# EAGLE design Zocalo-mcp2515 (EAGLE 7.4.0)
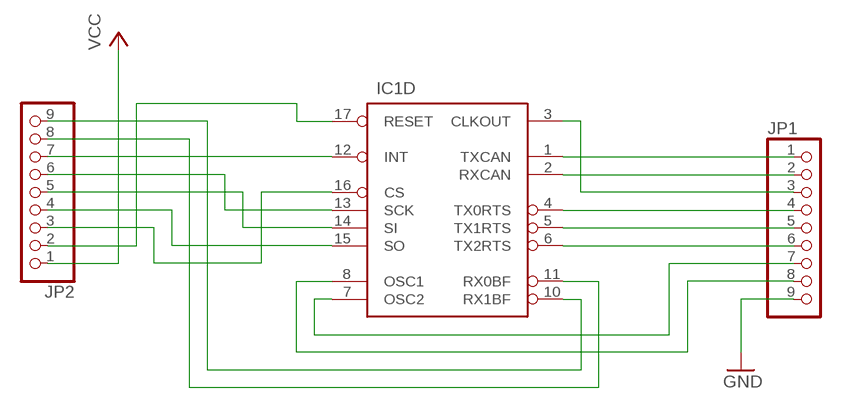
[diagram p0: schematic, sheet 1]

## Parts
IC1  MCP2515SO  [SO-18W]
JP1  PINHD-1X9  [1X09]
JP2  PINHD-1X9  [1X09]

## Nets
GND: JP1.9
N$1: IC1.1(D:TXCAN) JP1.1
N$2: IC1.2(D:RXCAN) JP1.2
N$3: IC1.4(D:TX0RTS) JP1.4
N$4: IC1.5(D:TX1RTS) JP1.5
N$5: IC1.6(D:TX2RTS) JP1.6
N$6: IC1.3(D:CLKOUT) JP1.3
N$7: IC1.7(D:OSC2) JP1.7
N$8: IC1.8(D:OSC1) JP1.8
N$9: IC1.10(D:RX1BF) JP2.9
N$10: IC1.11(D:RX0BF) JP2.8
N$11: IC1.12(D:INT) JP2.7
N$12: IC1.13(D:SCK) JP2.6
N$13: IC1.14(D:SI) JP2.5
N$14: IC1.15(D:SO) JP2.4
N$15: IC1.16(D:CS) JP2.3
N$16: IC1.17(D:RESET) JP2.2
VCC: JP2.1

## Power pins joined to a net without a drawn wire
GND: IC1.9(P:GND)
VCC: IC1.18(P:VCC)

## Library data of the parts
IC1 = can:MCP2515: MC2515 Stand-Alone CAN Controller With SPI Interface, Microchip
JP1 JP2 = pinhead:PINHD-1X9: PIN HEADER

## Board
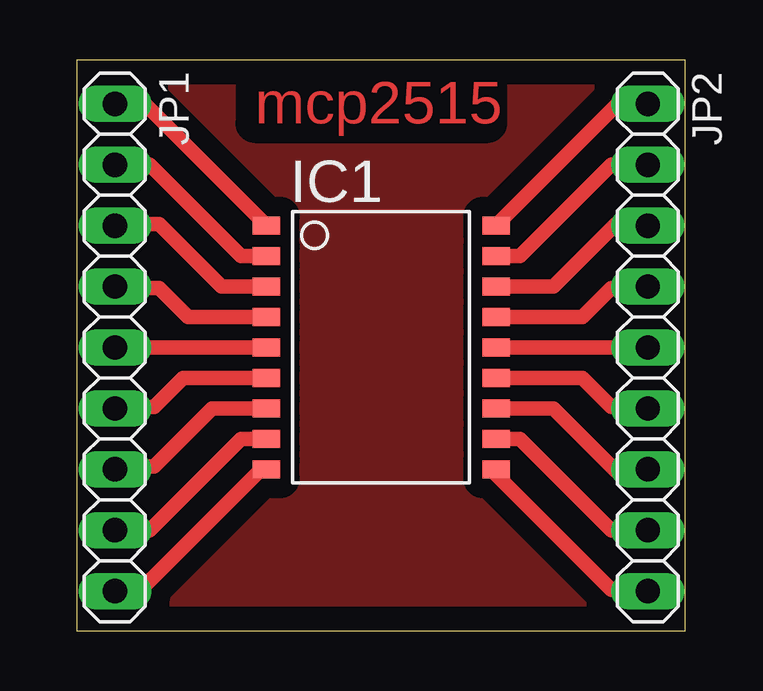
[diagram p1: board, top side]

Size 25.38 x 23.8 mm. Coordinates in mm from the lower left corner, seen from the top.
Outline: 0,0 25.38,0 25.38,23.8 0,23.8 0,0
Copper layers (1*16): Top 0.035mm / dielectric 1.5mm / Bottom 0.035mm
Design rules "default": minimum track width 10mil, minimum drill 24mil, track to track 8mil, track to pad 8mil, pad to pad 8mil, via to via 8mil, smd to smd 8mil, copper to edge 40mil, drill to drill 8mil, minimum pad ring 10mil, minimum via ring 8mil, stop-mask expansion 4mil, vias tented up to drill 0mil, thermal gap 10mil

### Footprints (pad centres in the part's own frame; a part is rotated, then mirrored left to right if it is on the bottom)
SO-18W = smd 0.762 x 1.143: 1 -5.08,-4.788; 2 -3.81,-4.788; 3 -2.54,-4.788; 4 -1.27,-4.788; 5 0,-4.788; 6 1.27,-4.788; 7 2.54,-4.788; 8 3.81,-4.788; 9 5.08,-4.788; 10 5.08,4.788; 11 3.81,4.788; 12 2.54,4.788; 13 1.27,4.788; 14 0,4.788; 15 -1.27,4.788; 16 -2.54,4.788; 17 -3.81,4.788; 18 -5.08,4.788
1X09 = drill 1.016 long: 1 -10.16,0; 2 -7.62,0; 3 -5.08,0; 4 -2.54,0; 5 0,0; 6 2.54,0; 7 5.08,0; 8 7.62,0; 9 10.16,0

### Placement (x,y rotation side)
IC1  12.7,11.81 270 top
JP1  1.59,11.81 270 top
JP2  23.81,11.81 270 top

### Tracks (layer width: path | path; a pad name or v marks a point on that pad's centre or on a via)
GND
  Top 0.61: IC1.9 7.68,6.73 2.67,1.71 1.65,1.71 JP1.9
N$1
  Top 0.61: JP1.1 2.83,21.97 IC1.1
N$2
  Top 0.61: IC1.2 6.86,15.62 3.05,19.43 JP1.2
N$3
  Top 0.61: IC1.4 4.64,13.08 3.43,14.29 1.65,14.29 JP1.4
N$4
  Top 0.61: JP1.5 IC1.5
N$5
  Top 0.61: IC1.6 4.45,10.54 3.24,9.34 1.65,9.34 JP1.6
N$6
  Top 0.61: IC1.3 6.03,14.35 3.43,16.95 1.65,16.95 JP1.3
N$7
  Top 0.61: IC1.7 5.65,9.27 3.24,6.86 1.71,6.86 JP1.7
N$8
  Top 0.61: IC1.8 6.86,8 3.05,4.19 JP1.8
N$9
  Top 0.61: IC1.10 17.49,6.51 22.29,1.71 23.75,1.71 JP2.9
N$10
  Top 0.61: IC1.11 18.48,8 22.29,4.19 JP2.8
N$11
  Top 0.61: IC1.12 19.88,9.27 22.48,6.67 23.75,6.67 JP2.7
N$12
  Top 0.61: IC1.13 21.08,10.54 22.29,9.34 23.75,9.34 JP2.6
N$13
  Top 0.61: IC1.14 JP2.5
N$14
  Top 0.61: IC1.15 21.08,13.08 22.29,14.29 23.75,14.29 JP2.4
N$15
  Top 0.61: IC1.16 19.88,14.35 22.48,16.95 23.75,16.95 JP2.3
N$16
  Top 0.61: IC1.17 18.48,15.62 22.29,19.43 JP2.2
N$17
  pour Top (isolate 0.813): 0,23.81 25.34,23.81 25.34,0 0,0
VCC
  Top 0.61: JP2.1 22.57,21.97 IC1.18

### Text on the board
Top: mcp2515